# EAGLE design openTPM-v14 (EAGLE 7.3.0)
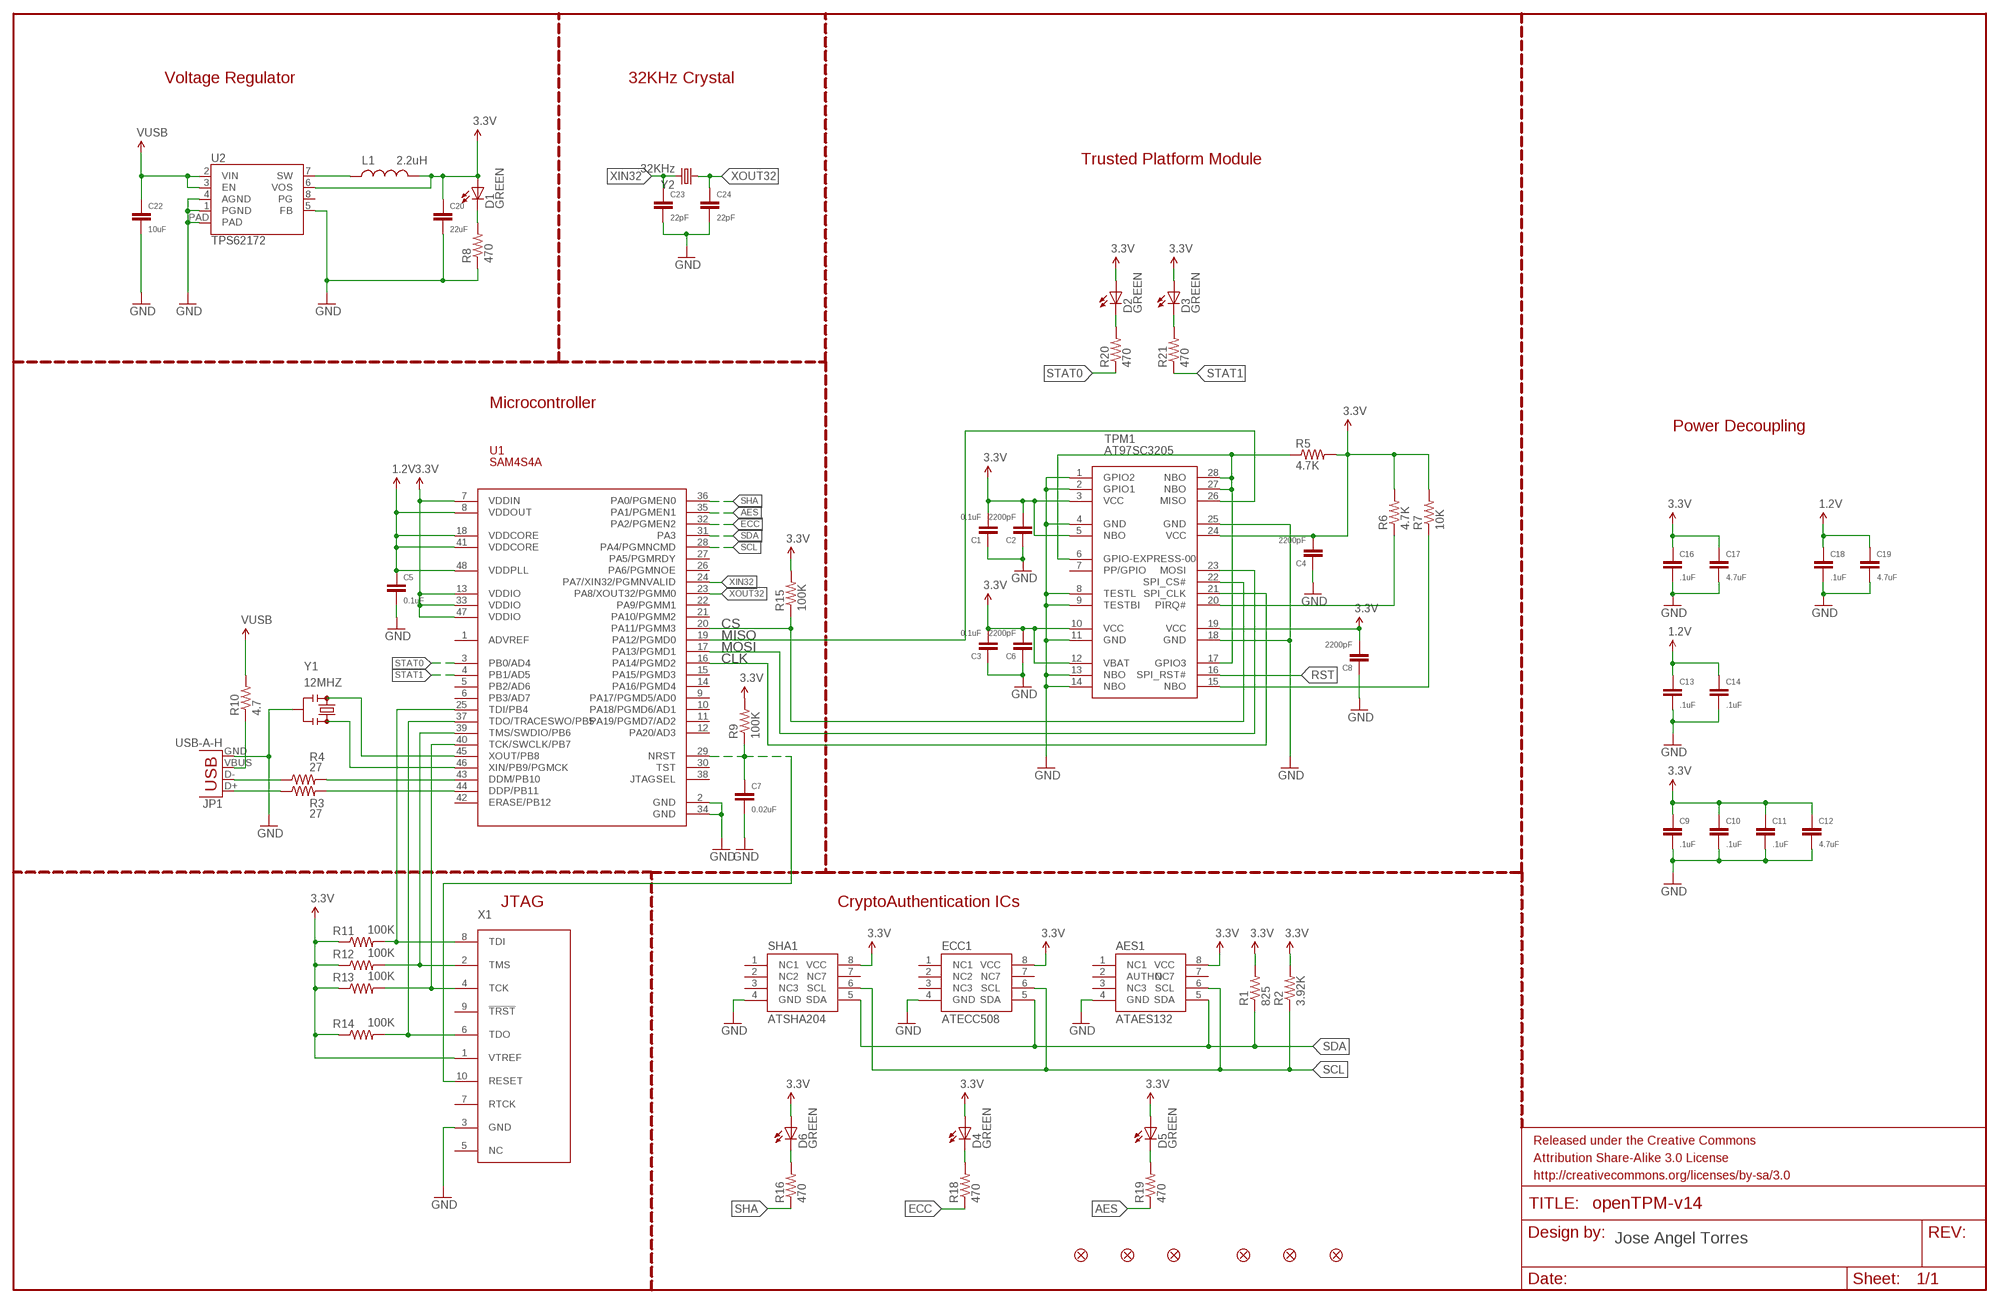
[diagram p0: schematic, sheet 1]

## Parts
AES1  ATAES132  CRYPTOTRONIX_ATAES132  [CRYPTOTRONIX_SOIC8]
C1  0.1uF  CAPACITOR.0402  [0402]
C2  2200pF  CAPACITOR.0402  [0402]
C3  0.1uF  CAPACITOR.0402  [0402]
C4  2200pF  CAPACITOR.0402  [0402]
C5  0.1uF  CAPACITOR.0402  [0402]
C6  2200pF  CAPACITOR.0402  [0402]
C7  0.02uF  CAPACITOR.0402  [0402]
C8  2200pF  CAPACITOR.0402  [0402]
C9  .1uF  CAPACITOR.0402  [0402]
C10  .1uF  CAPACITOR.0402  [0402]
C11  .1uF  CAPACITOR.0402  [0402]
C12  4.7uF  CAPACITOR.0402  [0402]
C13  .1uF  CAPACITOR.0402  [0402]
C14  .1uF  CAPACITOR.0402  [0402]
C16  .1uF  CAPACITOR.0402  [0402]
C17  4.7uF  CAPACITOR.0402  [0402]
C18  .1uF  CAPACITOR.0402  [0402]
C19  4.7uF  CAPACITOR.0402  [0402]
C20  22uF  CAPACITOR.0603  [0603]
C22  10uF  CAPACITOR.0402  [0402]
C23  22pF  CAPACITOR.0402  [0402]
C24  22pF  CAPACITOR.0402  [0402]
D1  GREEN  SPARKFUN-LED_LED-GREEN0603  [SPARKFUN-LED_LED-0603]
D2  GREEN  SPARKFUN-LED_LED-GREEN0603  [SPARKFUN-LED_LED-0603]
D3  GREEN  SPARKFUN-LED_LED-GREEN0603  [SPARKFUN-LED_LED-0603]
D4  GREEN  SPARKFUN-LED_LED-GREEN0603  [SPARKFUN-LED_LED-0603]
D5  GREEN  SPARKFUN-LED_LED-GREEN0603  [SPARKFUN-LED_LED-0603]
D6  GREEN  SPARKFUN-LED_LED-GREEN0603  [SPARKFUN-LED_LED-0603]
ECC1  ATECC508  [CRYPTOTRONIX_SOIC8]
FID1  SPARKFUN-AESTHETICS_FIDUCIAL1X2  [SPARKFUN-AESTHETICS_FIDUCIAL-1X2]
FID2  SPARKFUN-AESTHETICS_FIDUCIAL1X2  [SPARKFUN-AESTHETICS_FIDUCIAL-1X2]
FID3  SPARKFUN-AESTHETICS_FIDUCIAL1X2  [SPARKFUN-AESTHETICS_FIDUCIAL-1X2]
FID4  SPARKFUN-AESTHETICS_FIDUCIAL1X2  [SPARKFUN-AESTHETICS_FIDUCIAL-1X2]
FID5  SPARKFUN-AESTHETICS_FIDUCIAL1X2  [SPARKFUN-AESTHETICS_FIDUCIAL-1X2]
FID6  SPARKFUN-AESTHETICS_FIDUCIAL1X2  [SPARKFUN-AESTHETICS_FIDUCIAL-1X2]
JP1  USB-A-H  [USB-A-H]
L1  2.2uH  INDUCTOR0402  [C0402]
R1  825  RESISTOR.0402  [0402]
R2  3.92K  RESISTOR.0402  [0402]
R3  27  RESISTOR.0402  [0402]
R4  27  RESISTOR.0402  [0402]
R5  4.7K  RESISTOR.0402  [0402]
R6  4.7K  RESISTOR.0402  [0402]
R7  10K  RESISTOR.0402  [0402]
R8  470  RESISTOR.0402  [0402]
R9  100K  RESISTOR.0402  [0402]
R10  4.7  RESISTOR.0402  [0402]
R11  100K  RESISTOR.0402  [0402]
R12  100K  RESISTOR.0402  [0402]
R13  100K  RESISTOR.0402  [0402]
R14  100K  RESISTOR.0402  [0402]
R15  100K  RESISTOR.0402  [0402]
R16  470  RESISTOR.0402  [0402]
R18  470  RESISTOR.0402  [0402]
R19  470  RESISTOR.0402  [0402]
R20  470  RESISTOR.0402  [0402]
R21  470  RESISTOR.0402  [0402]
SHA1  ATSHA204  CRYPTOTRONIX_ATSHA204  [CRYPTOTRONIX_SOIC8]
TPM1  AT97SC3205  [TSSOP28]
U1  SAM4S4A  [LQFP-48]
U2  TPS62172  [WSON-8-PAD]
X1  TC2050-NL-MCP-NL  [TC2030-MCP-NL]
Y1  12MHZ  RESONATOR12MHZ  [RESONATOR-SMD]
Y2  32KHz  CRYSTALEPSONMC146  [CRYSTAL-32KHZ-SMD_EPSON_MC146]

## Nets
1.2V: C5.1 C13.1 C14.1 C18.1 C19.1 U1.8(VDDOUT) U1.18(VDDCORE) U1.41(VDDCORE) U1.48(VDDPLL)
3.3V: AES1.8(VCC) C1.2 C2.2 C3.2 C4.2 C6.2 C8.2 C9.1 C10.1 C11.1 C12.1 C16.1 C17.1 C20.1 D1.A D2.A D3.A D4.A D5.A D6.A ECC1.8(VCC) L1.2 R1.2 R2.2 R5.2 R6.2 R7.2 R9.2 R11.1 R12.1 R13.1 R14.1 R15.2 SHA1.8(VCC) TPM1.3(VCC) TPM1.5(NBO) TPM1.10(VCC) TPM1.12(VBAT) TPM1.19(VCC) TPM1.24(VCC) U1.7(VDDIN) U1.13(VDDIO) U1.33(VDDIO) U1.47(VDDIO) U2.6(VOS) X1.1(VTREF)
AES: R19.1 U1.35(PA1/PGMEN1)
CLK: TPM1.21(SPI_CLK) U1.16(PA14/PGMD2)
CS: R15.1 TPM1.22(SPI_CS#) U1.20(PA11/PGMM3)
ECC: R18.1 U1.32(PA2/PGMEN2)
GND: AES1.4(GND) C1.1 C2.1 C3.1 C4.1 C5.2 C6.1 C7.2 C8.1 C9.2 C10.2 C11.2 C12.2 C13.2 C14.2 C16.2 C17.2 C18.2 C19.2 C20.2 C22.2 C23.2 C24.2 ECC1.4(GND) JP1.GND R8.1 SHA1.4(GND) TPM1.1(GPIO2) TPM1.2(GPIO1) TPM1.4(GND) TPM1.8(TESTL) TPM1.9(TESTBI) TPM1.11(GND) TPM1.13(NBO) TPM1.14(NBO) TPM1.18(GND) TPM1.25(GND) U1.2(GND) U1.34(GND) U2.1(PGND) U2.4(AGND) U2.5(FB) U2.PAD X1.3(GND) Y1.2
MISO: TPM1.26(MISO) U1.19(PA12/PGMD0)
MOSI: TPM1.23(MOSI) U1.17(PA13/PGMD1)
N$1: R4.2 U1.43(DDM/PB10)
N$2: R3.2 U1.44(DDP/PB11)
N$3: R11.2 U1.25(TDI/PB4) X1.8(TDI)
N$4: R14.2 U1.37(TDO/TRACESWO/PB5) X1.6(TDO)
N$5: R12.2 U1.39(TMS/SWDIO/PB6) X1.2(TMS)
N$6: R13.2 U1.40(TCK/SWCLK/PB7) X1.4(TCK)
N$8: U1.45(XOUT/PB8) Y1.1
N$9: U1.46(XIN/PB9/PGMCK) Y1.3
N$10: R6.1 TPM1.20(PIRQ#)
N$11: JP1.D- R4.1
N$12: JP1.D+ R3.1
N$13: JP1.VBUS R10.1
N$14: R7.1 TPM1.15(NBO)
N$15: R5.1 TPM1.6(GPIO-EXPRESS-00) TPM1.17(GPIO3) TPM1.27(NBO) TPM1.28(NBO)
N$16: D4.C R18.2
N$17: L1.1 U2.7(SW)
N$18: D1.C R8.2
N$20: D6.C R16.2
N$21: D5.C R19.2
N$22: D2.C R20.2
N$23: D3.C R21.2
RST: C7.1 R9.1 TPM1.16(SPI_RST#) U1.29(NRST) X1.10(RESET)
SCL: AES1.6(SCL) ECC1.6(SCL) R2.1 SHA1.6(SCL) U1.28(PA4/PGMNCMD)
SDA: AES1.5(SDA) ECC1.5(SDA) R1.1 SHA1.5(SDA) U1.31(PA3)
SHA: R16.1 U1.36(PA0/PGMEN0)
STAT0: R20.1 U1.3(PB0/AD4)
STAT1: R21.1 U1.4(PB1/AD5)
VUSB: C22.1 R10.2 U2.2(VIN) U2.3(EN)
XIN32: C23.1 U1.24(PA7/XIN32/PGMNVALID) Y2.P$1
XOUT32: C24.1 U1.23(PA8/XOUT32/PGMM0) Y2.P$2
Unconnected: AES1.1(NC1) AES1.2(AUTHO) AES1.3(NC3) AES1.7(NC7) ECC1.1(NC1) ECC1.2(NC2) ECC1.3(NC3) ECC1.7(NC7) SHA1.1(NC1) SHA1.2(NC2) SHA1.3(NC3) SHA1.7(NC7) TPM1.7(PP/GPIO) U1.1(ADVREF) U1.5(PB2/AD6) U1.6(PB3/AD7) U1.9(PA17/PGMD5/AD0) U1.10(PA18/PGMD6/AD1) U1.11(PA19/PGMD7/AD2) U1.12(PA20/AD3) U1.14(PA16/PGMD4) U1.15(PA15/PGMD3) U1.21(PA10/PGMM2) U1.22(PA9/PGMM1) U1.26(PA6/PGMNOE) U1.27(PA5/PGMRDY) U1.30(TST) U1.38(JTAGSEL) U1.42(ERASE/PB12) U2.8(PG) X1.5(NC) X1.7(RTCK) X1.9(!TRST)

## Notes on the sheet
- Voltage Regulator | 32KHz Crystal
- Trusted Platform Module
- Microcontroller
- Power Decoupling
- JTAG | CryptoAuthentication ICs
- Jose Angel Torres

## Library data of the parts
AES1 = TPM:CRYPTOTRONIX_ATAES132: 32Kb Serial EEPROM. AES-128-CCM. MAC. Secure Storage for 128-bit keys. Encrypted User Memory Readn and Write. HWRNG. 2.5V to 5.5V.
C1-C14 C16-C20 C22-C24 = TPM:CAPACITOR
D1-D6 = TPM:SPARKFUN-LED_LED-GREEN: Various green LEDs 0603- DIO-00821 LARGE- DIO-00862 LILYPAD- DIO-09910; PROD_ID: DIO-00821
ECC1 = TPM:ATECC508: ATECC108: Provides ECDSA with NIST curves P256, B283, and K283. Also, a RNG, 8.5Kb EEPROM. 2.0V - 5.5V.
FID1-FID6 = TPM:SPARKFUN-AESTHETICS_FIDUCIAL: Fiducial Alignment Points Various fiducial points for machine vision alignment.
JP1 = TPM:USB: USB Connectors USB-B-PTH is fully proven SKU : PRT-00139/CONN-08278 USB-miniB is fully proven SKU : PRT-00587 USB-A-PCB is untested. USB-A-H is throughly reviewed, but untested. Spark Fun Electronics SKU : PRT-00437 USB-B-SMT is throughly reviewed, but untested. Needs silkscreen touching up. USB-A-S has not been used/tested USB-MB-H has not been used/tested USB-MICROB has been used. CONN-09505; PROD_ID: CONN-08367
L1 = TPM:INDUCTOR: Inductors Basic Inductor/Choke - 0603 and 1206. Footprints are not proven and vary greatly between part numbers. INDUCTOR POWER 3.3UH 4.0A SMD 0.197" L x 0.197" W x 0.177" H (5.00mm x 5.00mm x 4.50mm)
R1-R16 R18-R21 = TPM:RESISTOR
SHA1 = TPM:CRYPTOTRONIX_ATSHA204: ATSHA204
TPM1 = TPM:AT97SC3205: Atmel TPM 1.2
U1 = TPM:SAM4S4A
U2 = TPM:TPS62172: Texas Instruments TPS62172 3-17V 0.5A Step-Down Converter with DCS control. Available in adjustable and fixed output voltage versions. Is packaged in an 8-pin WSON package measuring 2 × 2 mm (DSG). See a 3.3V fixed output version of this chip in action on the Electric Imp Breakout Board <https://www.sparkfun.com/products/11400>. Datasheet <http://www.ti.com/lit/gpn/tps62172>; PROD_ID: IC-11307
X1 = TPM:TC2050-NL: TAG-CONNECT ISP Connector Manufacturer: Tag-Connect <www.tag-connect.com> Cable for easy In-Circuit PCB Programming. Designed for JTAG 10 pin, suitable for many others. Pin Connection for TC2050 NL. PAD Description 1 VTREF 2 TMS 3 GND 4 TCK 5 NC 6 TDO 7 RTCK 8 TDI 9 !TRST 10 RESET ©2009 ROFA.cz Modified 7/2011 by Tim McCarthy-Smith VIDA Products INC
Y1 = TPM:RESONATOR: Resonator Small SMD resonator. Used, eg, on the Arduino Pro/ Pro Mini boards. 8MHz- XTAL-08895 16MHz- XTAL-08900; PROD_ID: XTAL-08900; VALUE: 16MHZ
Y2 = TPM:CRYSTAL: Various standard crystals. Proven footprints.

## Board
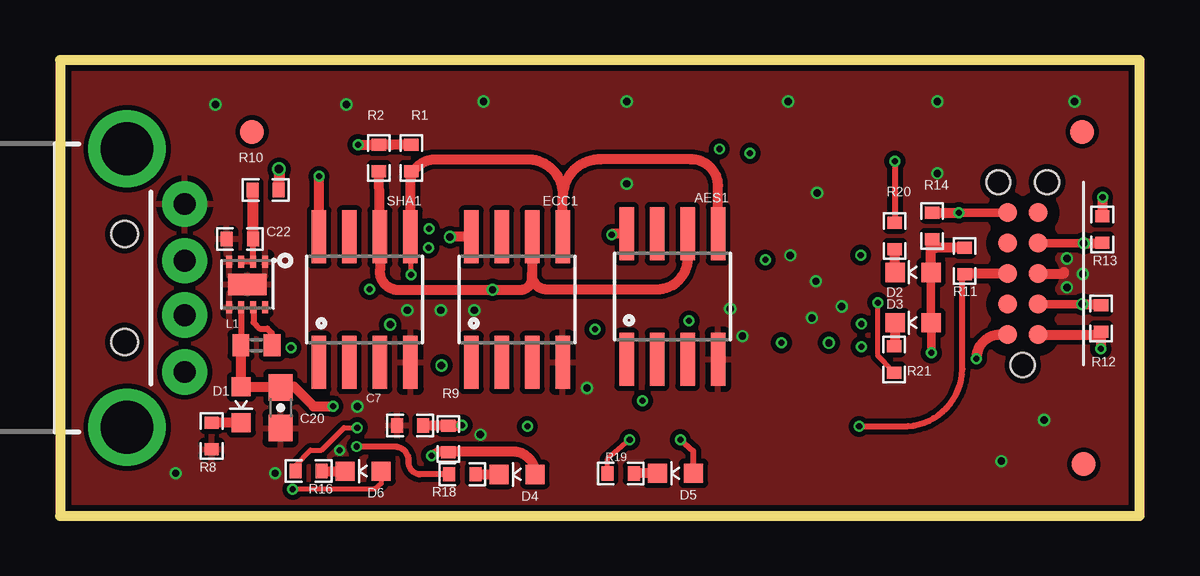
[diagram p1: board, top side]
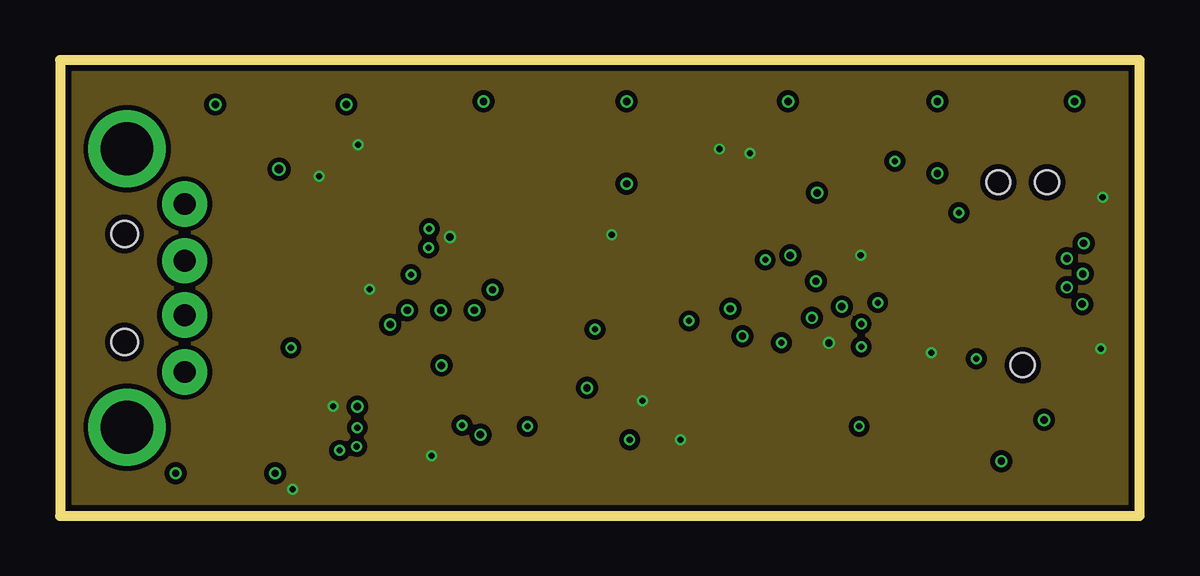
[diagram p2: board, inner layer Route2]
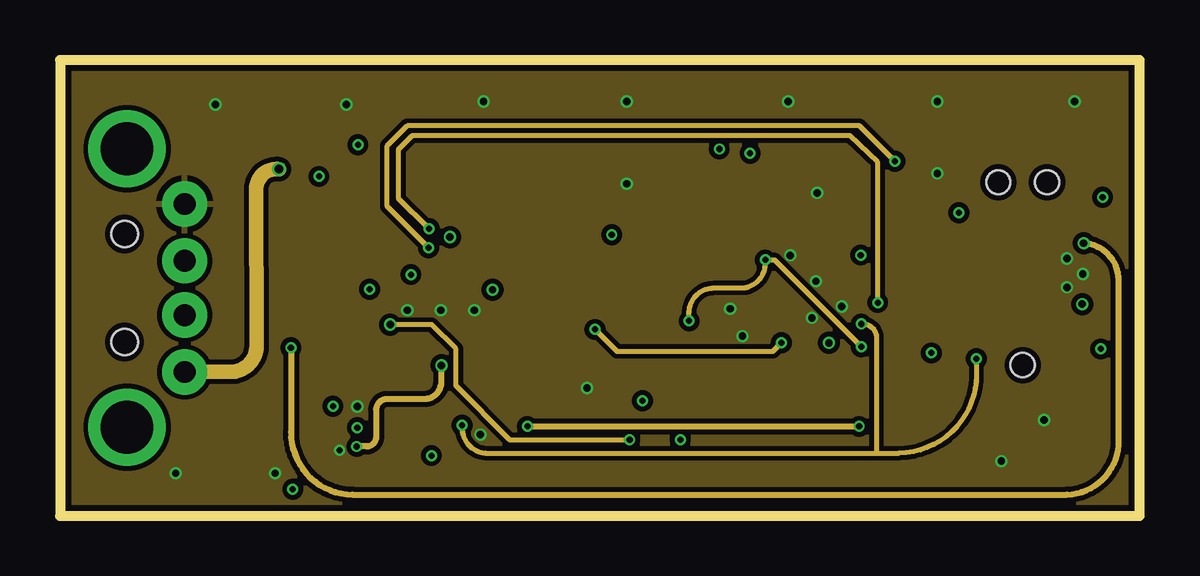
[diagram p3: board, inner layer Route15]
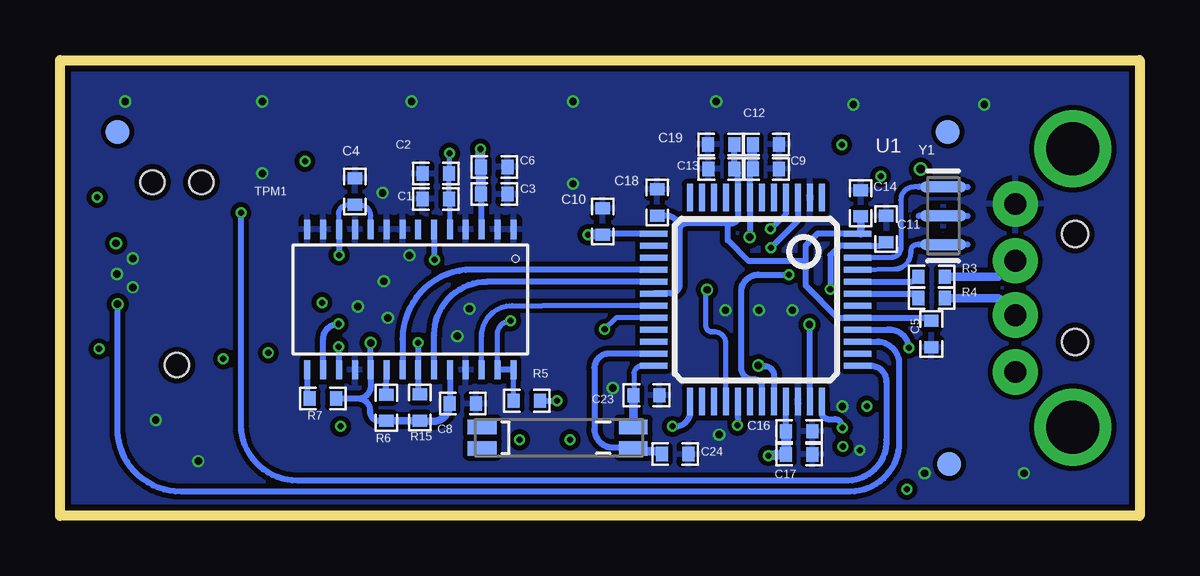
[diagram p4: board, bottom side, seen from below]

Size 45.01 x 19 mm. Coordinates in mm from the lower left corner, seen from the top.
Outline: 0,0 45.01,0 45.01,19 0,19 0,0
Copper layers (1*2*15*16): Top 0.035mm / dielectric 0.2mm / Route2 0.0175mm / dielectric 0.3mm / Route15 0.0175mm / dielectric 0.2mm / Bottom 0.035mm
Design rules "SeeedStudio_4layer_DRU_no_angle_20140221 *": minimum track width 8mil, minimum drill 10mil, track to track 8mil, track to pad 8mil, pad to pad 8mil, via to via 8mil, smd to smd 0mil, copper to edge 10mil, drill to drill 8mil, minimum pad ring 6mil, minimum via ring 4mil, stop-mask expansion 4mil, vias tented up to drill 100mil, thermal gap 10mil

### Footprints (pad centres in the part's own frame; a part is rotated, then mirrored left to right if it is on the bottom)
CRYPTOTRONIX_SOIC8 = smd 0.61 x 2.21: 1 -1.905,-2.616; 2 -0.635,-2.616; 3 0.635,-2.616; 4 1.905,-2.616; 5 1.905,2.616; 6 0.635,2.616; 7 -0.635,2.616; 8 -1.905,2.616
0402 = smd 0.5 x 0.6: 1 -0.55,0; 2 0.55,0
0603 = smd 1.1 x 1: 1 -0.85,0; 2 0.85,0
SPARKFUN-LED_LED-0603 = smd 0.8 x 0.8: A 0,-0.75; C 0,0.75
SPARKFUN-AESTHETICS_FIDUCIAL-1X2 = smd 1 x 1: 1 0,0
USB-A-H = drill 0.914 pad 1.88: D+ 2.4,1.127; D- 2.4,-1.127; GND 2.4,3.5; VBUS 2.4,-3.5 | drill 2.2: GND2 0,-5.8; GND3 0,5.8 | hole 1.1: -0.1,2.25; -0.1,-2.25
C0402 = smd 0.7 x 0.9: 1 -0.65,0; 2 0.65,0
TSSOP28 = smd 0.8 x 0.25: 1 -2.921,4.623; 2 -2.921,3.962; 3 -2.921,3.302; 4 -2.921,2.642; 5 -2.921,1.981; 6 -2.921,1.321; 7 -2.921,0.66; 8 -2.927,0; 9 -2.921,-0.66; 10 -2.921,-1.321; 11 -2.921,-1.981; 12 -2.921,-2.642; 13 -2.921,-3.302; 14 -2.921,-3.962; 15 2.921,-3.962; 16 2.921,-3.302; 17 2.921,-2.642; 18 2.921,-1.981; 19 2.921,-1.321; 20 2.921,-0.66; 21 2.927,0; 22 2.921,0.66; 23 2.921,1.321; 24 2.921,1.981; 25 2.921,2.642; 26 2.921,3.302; 27 2.921,3.962; 28 2.921,4.623
LQFP-48 = smd 0.254 x 1.143: 1 -2.75,-4.25; 2 -2.25,-4.25; 3 -1.75,-4.25; 4 -1.25,-4.25; 5 -0.75,-4.25; 6 -0.25,-4.25; 7 0.25,-4.25; 8 0.75,-4.25; 9 1.25,-4.25; 10 1.75,-4.25; 11 2.25,-4.25; 12 2.75,-4.25; 25 2.75,4.25; 26 2.25,4.25; 27 1.75,4.25; 28 1.25,4.25; 29 0.75,4.25; 30 0.25,4.25; 31 -0.25,4.25; 32 -0.75,4.25; 33 -1.25,4.25; 34 -1.75,4.25; 35 -2.25,4.25; 36 -2.75,4.25 | smd 1.143 x 0.254: 13 4.25,-2.75; 14 4.25,-2.25; 15 4.25,-1.75; 16 4.25,-1.25; 17 4.25,-0.75; 18 4.25,-0.25; 19 4.25,0.25; 20 4.25,0.75; 21 4.25,1.25; 22 4.25,1.75; 23 4.25,2.25; 24 4.25,2.75; 37 -4.25,2.75; 38 -4.25,2.25; 39 -4.25,1.75; 40 -4.25,1.25; 41 -4.25,0.75; 42 -4.25,0.25; 43 -4.25,-0.25; 44 -4.25,-0.75; 45 -4.25,-1.25; 46 -4.25,-1.75; 47 -4.25,-2.25; 48 -4.25,-2.75
WSON-8-PAD = smd 0.25 x 0.5: 1 -0.75,-0.95; 2 -0.25,-0.95; 3 0.25,-0.95; 4 0.75,-0.95; 5 0.75,0.95; 6 0.25,0.95; 7 -0.25,0.95; 8 -0.75,0.95 | smd 1.6 x 0.9: PAD 0,0
TC2030-MCP-NL = smd 0.787 x 0.787: 1 1.27,-0.635; 2 2.54,-0.635; 3 3.81,-0.635; 4 5.08,-0.635; 5 6.35,-0.635; 6 6.35,0.635; 7 5.08,0.635; 8 3.81,0.635; 9 2.54,0.635; 10 1.27,0.635 | hole 1: 0,0; 7.62,-1.016; 7.62,1.016
RESONATOR-SMD = smd 0.45 x 1.905: 1 -1.2,0; 2 0,0; 3 1.2,0
CRYSTAL-32KHZ-SMD_EPSON_MC146 = smd 1.2 x 0.6: NC1 6.9,1.2; NC2 6.9,0.3; P$1 0.6,0.3; P$2 0.6,1.2

### Placement (x,y rotation side)
AES1  25.53,9.14 0 top
C1  29.34,13.21 0 bottom
C2  29.34,14.26 0 bottom
C3  26.91,13.41 180 bottom
C4  32.72,13.53 270 bottom
C5  8.69,7.58 270 bottom
C6  26.91,14.54 180 bottom
C7  14.59,3.77 180 top
C8  28.22,4.69 180 bottom
C9  15.58,14.47 0 bottom
C10  22.39,12.27 90 bottom
C11  10.57,11.96 90 bottom
C12  15.58,15.48 0 bottom
C13  17.44,14.47 180 bottom
C14  11.63,13.03 90 bottom
C16  14.2,3.53 0 bottom
C17  14.2,2.57 0 bottom
C18  20.12,13.07 90 bottom
C19  17.45,15.48 180 bottom
C20  9.19,4.51 270 top
C22  7.49,11.54 180 top
C23  20.56,5.03 0 bottom
C24  19.37,2.58 0 bottom
D1  7.56,4.64 180 top
D2  35.56,10.15 90 top
D3  35.56,8.05 90 top
D4  19.05,1.73 90 top
D5  25.65,1.78 90 top
D6  12.64,1.87 90 top
ECC1  19.05,9.02 0 top
FID1  42.61,16 0 top
FID2  8,16 0 top
FID3  42.67,2.16 0 top
FID4  8,16 0 bottom
FID5  7.94,2.16 0 bottom
FID6  42.61,16 0 bottom
JP1  2.79,9.5 0 top
L1  8.19,7.11 180 top
R1  14.64,14.92 90 top
R2  13.3,14.92 90 top
R3  8.67,9.97 180 bottom
R4  8.67,9.08 180 bottom
R5  25.55,4.8 0 bottom
R6  31.41,4.51 270 bottom
R7  34.05,4.89 0 bottom
R8  6.32,3.33 90 top
R9  16.18,3.21 270 top
R10  8.57,13.59 180 top
R11  37.71,10.63 270 top
R12  43.4,8.23 90 top
R13  43.45,11.94 270 top
R14  36.35,12.09 90 top
R15  30.01,4.52 270 bottom
R16  10.36,1.87 0 top
R18  16.78,1.74 0 top
R19  23.37,1.78 0 top
R20  34.8,11.67 270 top
R21  34.77,6.53 90 top
SHA1  12.7,9.02 0 top
TPM1  30.73,9.02 270 bottom
U1  16,9.02 180 bottom
U2  7.81,9.65 180 top
X1  40.13,6.29 90 top
Y1  8.19,12.51 90 bottom
Y2  20.51,4.01 180 bottom

### Tracks (layer width: path | path; a pad name or v marks a point on that pad's centre or on a via)
1.2V
  Bottom 0.203: U1.18 arc-90 U1.18 | 8.91,8.27 C5.1 | 11.77,8.26 U1.41
  Bottom 0.254: 19.18,11.94 19.18,9.65 arc90 19.56,9.27 U1.18 | U1.41 8.91,8.27 | 11.77,8.26 12.6,8.26 13.92,9.6 13.92,10.62 | 17.17,12.19 17.02,12.19 arc-90 16.75,12.46 U1.8 16.75,14.25 arc-90 C13.1 | 17.17,12.19 18.92,12.19 arc-90 19.18,11.94 | 13.92,10.62 16.31,10.62 17.17,11.48 17.17,12.19 | 13.92,10.62 13.92,11.28 13.43,11.77 U1.48 11.63,11.77 | C13.1 16.93,14.44 | C13.1 16.89,15.47 C19.1 | 19.18,11.94 arc-90 19.76,12.52 C18.1
  Bottom 0.305: C14.1 11.63,11.77
3.3V  (via drill 0.25, 0.3)
  Top 0.203: 9.31,5.39 C20.1 9.2,5.38 | 7.56,7.1 L1.2 7.56,7.13 | R9.2 arc90 16.18,2.69 | 36.32,8.06 arc90 D3.A | 36.32,6.86 arc90 v36.32,6.79 | 16.27,11.63 arc90 v16.26,11.62 | 23.04,11.76 arc90 v23,11.72 | D6.A 13.39,1.35 13.11,1.12 v9.7,1.12
  Top 0.254: U2.6 7.56,7.13 | D5.A 26.4,2.7 v25.86,3.17 | R13.1 43.46,12.61 | R12.1 43.38,7.66 | 16.26,11.63 v16.26,11.62
  Top 0.356: D3.A D2.A | 36.32,8.06 36.32,6.86
  Top 0.406: 9.31,5.39 D1.A 7.56,7.1 | 16.18,2.69 18.91,2.69 arc-90 D4.A | v15.48,2.52 15.82,2.69 R9.2 | R1.2 13.84,15.46 R2.2 v12.42,15.47 | AES1.8 23.04,11.76 | SHA1.8 v10.79,14.15 | 9.2,5.38 9.75,5.38 10.57,4.57 v11.38,4.57 | 43.46,12.61 v43.46,13.28 | 43.38,7.66 v43.38,6.96 | ECC1.8 16.26,11.63 | X1.1 43.27,7.56 R12.1 | D2.A 36.31,11.02 | 36.31,11.02 36.31,11.5 R14.1 | R11.1 36.47,11.18 36.31,11.02
  Bottom 0.203: C8.2 28.75,4.78 28.77,4.76 | 14.74,2.52 arc90 C17.1 | 14.74,4.75 arc-90 U1.33 | TPM1.5 28.75,13.2 arc-90 C1.2 C2.2 28.76,15.11 v28.77,15.11 | 16.25,14.4 arc-90 C9.1 | 16.14,15.32 arc90 C12.1 | TPM1.10 32.05,12.5 arc-90 32.51,12.95 | 32.51,12.95 33.02,12.95 arc-90 33.4,12.57 33.4,11.96 | 33.4,11.96 arc-90 TPM1.12 | 27.43,13.2 arc-90 C3.2 | v16.25,11.62 arc90 v16.26,11.62 | 32.51,12.95 C4.2 | 10.83,11.27 C11.1 | 33.4,11.96 33.38,11.96
  Bottom 0.254: TPM1.24 28.75,4.78 | C16.1 14.74,4.75 | 16.25,14.4 U1.7 v16.25,11.62 | 32.58,4.89 arc-90 32.05,5.41 TPM1.19 v32.05,7.21 | 32.58,4.89 R7.2 | TPM1.3 27.43,13.2 | R5.2 v24.28,4.8 | 10.83,11.27 U1.47 12.51,11.27 12.9,10.87 v12.9,9.45 | 33.38,11.96 v33.38,10.87 | U1.13 22.39,11.77 C10.1 | R6.2 31.7,3.96 arc90 32.08,4.34 32.08,4.39 arc-90 32.58,4.89
  Bottom 0.305: C8.2 28.77,4.63 arc90 29.46,3.94 29.98,3.94 arc90 R15.2 31.37,3.97 arc-90 R6.2
  Bottom 0.406: C16.1 14.74,2.52 | C9.1 16.14,15.32 | C17.1 v15.48,2.52 | v27.48,15.29 27.48,14.34 C6.2 C3.2 | C10.1 v23,11.72
  pour Route2: 0,19.05 0,0 45.09,0 45.09,1.4 45.09,19.05
AES  (via drill 0.25, 0.3)
  Top 0.203: v23.75,3.17 22.81,2.36 R19.1
  Route15 0.203: v13.77,7.98 15.49,7.98 16.51,6.96 16.51,5.44 18.75,3.17 v23.75,3.17
  Bottom 0.203: 13.77,4.78 arc-90 U1.35
  Bottom 0.254: v13.77,7.98 13.77,4.78
CLK
  Bottom 0.254: U1.16 27.83,10.27 arc-90 30.73,7.37 TPM1.21
CS  (via drill 0.25)
  Route15 0.203: v22.3,7.77 23.22,6.86 29.72,6.86 v30.07,7.21
  Bottom 0.203: 30.07,5.32 arc-90 R15.1 | U1.20 21.81,8.27 v22.3,7.77
  Bottom 0.254: 30.07,5.32 TPM1.22 v30.07,7.21
ECC  (via drill 0.25, 0.3)
  Top 0.254: R18.1 15.02,1.74 arc-90 14.53,2.23 14.53,2.31 arc90 13.95,2.9 v12.37,2.9
  Route15 0.254: v15.9,6.27 15.9,5.59 arc-90 15.19,4.88 13.64,4.88 arc90 13.18,4.42 13.18,3.3 arc-90 12.78,2.9 v12.37,2.9
  Bottom 0.203: U1.32 arc90 U1.32
  Bottom 0.254: v15.9,6.27 15.65,6.25 arc90 15.24,5.84 U1.32
GND  (via drill 0.25, 0.3)
  Top 0.406: X1.3 41.85,10.1 41.85,10.16
  other vias: 27.94,8.64 28.45,7.49 6.48,17.14 11.94,17.14 17.65,17.27 23.62,17.27 30.35,17.27 36.58,17.27 42.29,17.27 41.02,4 39.24,2.29 21.97,5.33 11.66,2.73 23.62,13.84 31.34,8.26 32.59,8.72 31.51,9.78 31.56,13.46 30.44,10.86 15.88,8.57 17.27,8.57 14.48,8.57 41.97,9.53 41.97,10.73 4.83,1.78 17.53,3.39 8.97,1.78 42.63,10.08 36.58,14.27 12.4,4.56
  pour Bottom: -0.13,19.05 45.09,19.05 45.09,0 0,0
  pour Top: 0,19.05 0,0 45.09,0 45.09,1.4 45.09,19.05
  pour Route15: 0,19.05 0,0 45.09,0 45.09,1.4 45.09,19.05
MISO
  Bottom 0.203: U1.19 24.89,8.77 arc90 24.89,8.76 26.16,8.76 arc-90 27.43,7.49 TPM1.26
MOSI
  Bottom 0.254: U1.17 27.19,9.77 arc-90 29.41,7.54 TPM1.23
N$1
  Bottom 0.254: U1.43 9.53,9.27 R4.2
N$2
  Bottom 0.254: U1.44 9.5,9.77 R3.2
N$3  (via drill 0.25)
  Top 0.203: 37.62,9.94 R11.2
  Top 0.254: v33.31,3.73 35.13,3.73 arc90 37.62,6.12 37.62,9.94
  Top 0.406: X1.8 37.83,10.1 R11.2
  Route15 0.254: v19.48,3.73 v33.31,3.73
  Bottom 0.203: U1.25 18.75,4.24
  Bottom 0.254: 18.75,4.24 arc90 v19.48,3.73
N$4  (via drill 0.25)
  Top 0.203: 37.46,12.64 v37.47,12.64
  Top 0.356: v37.47,12.64 X1.6
  Top 0.406: R14.2 37.46,12.64
  Bottom 0.254: U1.37 11.22,6.27 arc90 10.57,5.59 10.57,3.17 arc90 12.14,1.47 35.1,1.47 arc90 37.47,3.81 v37.47,12.64
N$5  (via drill 0.3)
  Top 0.203: 43.36,8.83 arc-90 R12.2
  Top 0.356: v42.61,8.83 X1.2
  Top 0.406: v42.61,8.83 43.36,8.83
  Bottom 0.254: U1.39 10.95,7.27 arc90 10.03,6.35 10.03,3.1 arc90 12.06,1.02 39.95,1.02 arc90 42.61,3.62 v42.61,8.83
N$6  (via drill 0.25, 0.3)
  Top 0.203: 43.36,11.37 R13.2
  Top 0.356: v42.67,11.37 X1.4
  Top 0.406: v42.67,11.37 43.36,11.37
  Route15 0.254: v9.63,7.01 9.63,3.5 arc90 12.19,0.89 41.97,0.89 arc90 44.13,3.17 44.13,9.72 arc90 v42.67,11.37
  Bottom 0.254: U1.40 10.51,7.77 arc90 v9.63,7.01
N$8
  Bottom 0.203: U1.45 10.19,10.29 arc-90 9.54,11.02 arc105 9.23,11.31 9.21,11.31
N$9
  Bottom 0.203: 9.21,13.71 9.42,13.71 arc-90 9.96,13.17 9.96,11.16 arc90 10.38,10.77 11.67,10.77 arc-90 U1.46
N$10
  Bottom 0.203: 31.4,6.08 TPM1.20
  Bottom 0.254: R6.1 31.4,6.08
N$11
  Bottom 0.356: R4.1 5.9,9.08 JP1.D-
N$12
  Bottom 0.356: R3.1 5.9,9.97 JP1.D+
N$13  (via drill 0.36)
  Top 0.457: v9.13,14.45 R10.1
  Route15 0.61: JP1.VBUS 7.09,6 arc90 8.2,7.11 8.18,13.7 arc-90 v9.13,14.45
N$14
  Bottom 0.254: TPM1.15 34.7,4.99 arc-90 R7.1
N$15  (via drill 0.25)
  Route15 0.203: v26.23,8.13 26.23,8.5 arc-90 27.28,9.5 28.49,9.5 arc90 v29.4,10.67 29.78,10.67 v33.4,7.05
  Bottom 0.203: R5.1 TPM1.28 | TPM1.27 26.77,7.58 arc90 v26.23,8.13 | 29.4,11.93 arc-90 TPM1.6 | 33.38,7.07 arc90 v33.4,7.05
  Bottom 0.254: TPM1.28 TPM1.27 | v29.4,10.67 29.4,11.93 | TPM1.17 33.38,7.07
N$16
  Top 0.203: 18.31,1.74 D4.C
  Top 0.406: R18.2 18.31,1.74
N$17
  Top 0.203: U2.7 | 8.83,7.13 L1.1
  Top 0.254: U2.7 8.06,8.06 8.32,7.81 8.64,7.81 8.83,7.62 8.83,7.13
N$18
  Top 0.203: 6.38,3.88 R8.2
  Top 0.406: D1.C 6.38,3.88
N$20
  Top 0.406: R16.2 D6.C
N$21
  Top 0.406: D5.C R19.2
N$22
  Top 0.203: 34.81,11.03 arc90 R20.2
  Top 0.406: D2.C 34.81,11.03
N$23
  Top 0.203: 34.81,7.2 arc-90 R21.2
  Top 0.406: D3.C 34.81,7.2
RST  (via drill 0.25)
  Top 0.203: 16.08,3.78 R9.1 | 16.76,3.77 v16.76,3.79
  Top 0.406: v38.2,6.55 arc-90 39.18,7.56 X1.10 | C7.1 16.08,3.78 | R9.1 16.76,3.77
  Route15 0.203: v16.76,3.79 arc90 17.73,2.62 34.04,2.62 | 34.04,2.62 34.98,2.62 arc90 38.2,5.94 v38.2,6.55 | v33.4,8 33.47,8 arc-90 34.04,7.43 34.04,2.62
  Bottom 0.254: TPM1.16 34.04,7.37 arc90 v33.4,8 | v16.76,3.79 16.76,3.86 16.75,4.1 U1.29
SCL  (via drill 0.3)
  Top 0.203: 13.31,14.28 arc-90 R2.1
  Top 0.254: 26.16,10.92 AES1.6
  Top 0.406: 19.68,10.13 arc90 20.19,9.45 25.03,9.45 arc90 26.16,10.92 | 19.68,10.13 19.68,9.89 arc-90 19.15,9.42 v18.03,9.42 14.03,9.42 arc-90 13.34,10.25 SHA1.6 13.31,14.28 | ECC1.6 19.68,10.13
  Bottom 0.203: U1.28 17.25,7.19 arc-90 17.73,7.67 17.83,7.67 arc90 18.09,7.92 18.09,9.4 arc90 v18.03,9.42
SDA  (via drill 0.25)
  Top 0.203: R1.1 14.61,13.85 arc-90 14.61,13.84 | v14.63,10.06 14.63,11.61 arc90 SHA1.5
  Top 0.406: AES1.5 27.43,13.78 arc90 26.29,14.86 22.54,14.86 arc90 20.95,13.34 | SHA1.5 14.61,13.84 arc-90 15.62,14.86 19.56,14.86 arc-90 20.95,13.34 | ECC1.5 20.95,13.34
  Bottom 0.254: U1.31 15.75,5.39 arc-90 16.05,5.69 16.1,5.69 arc90 16.61,6.15 16.61,9.35 arc90 15.88,10.06 v14.63,10.06
SHA  (via drill 0.25)
  Top 0.203: R16.1 arc90 R16.1 9.82,2.1 10.44,2.74 10.9,2.74 11.84,3.68 v12.39,3.68
  Bottom 0.254: U1.36 13.25,4.31 arc-90 13.01,4.04 12.72,4.04 arc90 v12.39,3.68
STAT0  (via drill 0.25)
  Top 0.254: v34.8,14.78 R20.1
  Route15 0.203: v34.8,14.79 v34.8,14.78 33.33,16.26 14.48,16.26 13.64,15.42 13.64,12.9 v15.37,11.18
  Bottom 0.254: U1.3 14.25,12.29 v15.37,11.18
STAT1  (via drill 0.25)
  Top 0.203: R21.1 34.39,6.38 34.09,6.68 v34.09,8.89
  Route15 0.203: v34.09,8.89 34.09,14.73 32.92,15.85 14.68,15.85 14.12,15.29 14.12,13.21 v15.39,11.96
  Bottom 0.203: 14.73,13.29 U1.4
  Bottom 0.254: U1.4 14.75,12.58 v15.39,11.96
VUSB
  Top 0.203: 8.04,13.57 arc90 R10.2 | C22.1 8.04,11.63 arc90 8.06,11.61
  Top 0.254: U2.3 U2.2 8.06,11.61
  Top 0.457: C22.1 8.04,13.57
XIN32
  Bottom 0.203: 21.11,4.96 arc90 C23.1 arc-90 21.08,4.99 21.08,5.96 arc90 20.67,6.27 U1.24
  Bottom 0.356: Y2.P$1 21.11,4.96
XOUT32
  Bottom 0.203: 21.12,2.86 arc-90 Y2.P$2
  Bottom 0.254: U1.23 22.12,6.77 arc-90 22.73,6.16 22.73,3.62 arc-90 21.97,2.86 21.12,2.86 | C24.1 arc-90 20.03,2.69 | 20.6,2.69 arc-90 20.72,2.81 Y2.P$2
  Bottom 0.356: 20.03,2.69 20.6,2.69